# EasyEDA Pro project ProPrj_[LiThermal]热成像相机.epro, board V1.2_PCB
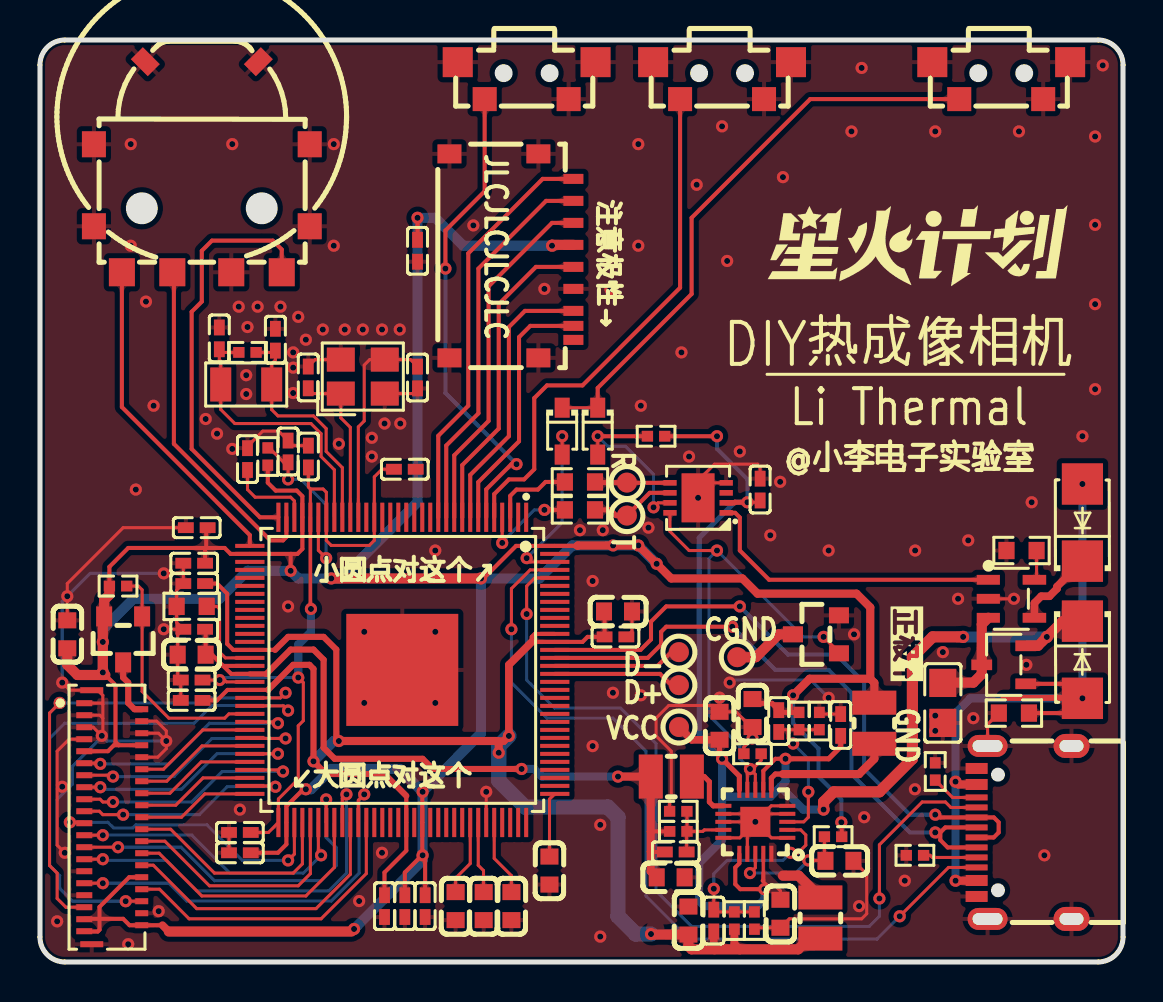
[diagram p6: board, top side]
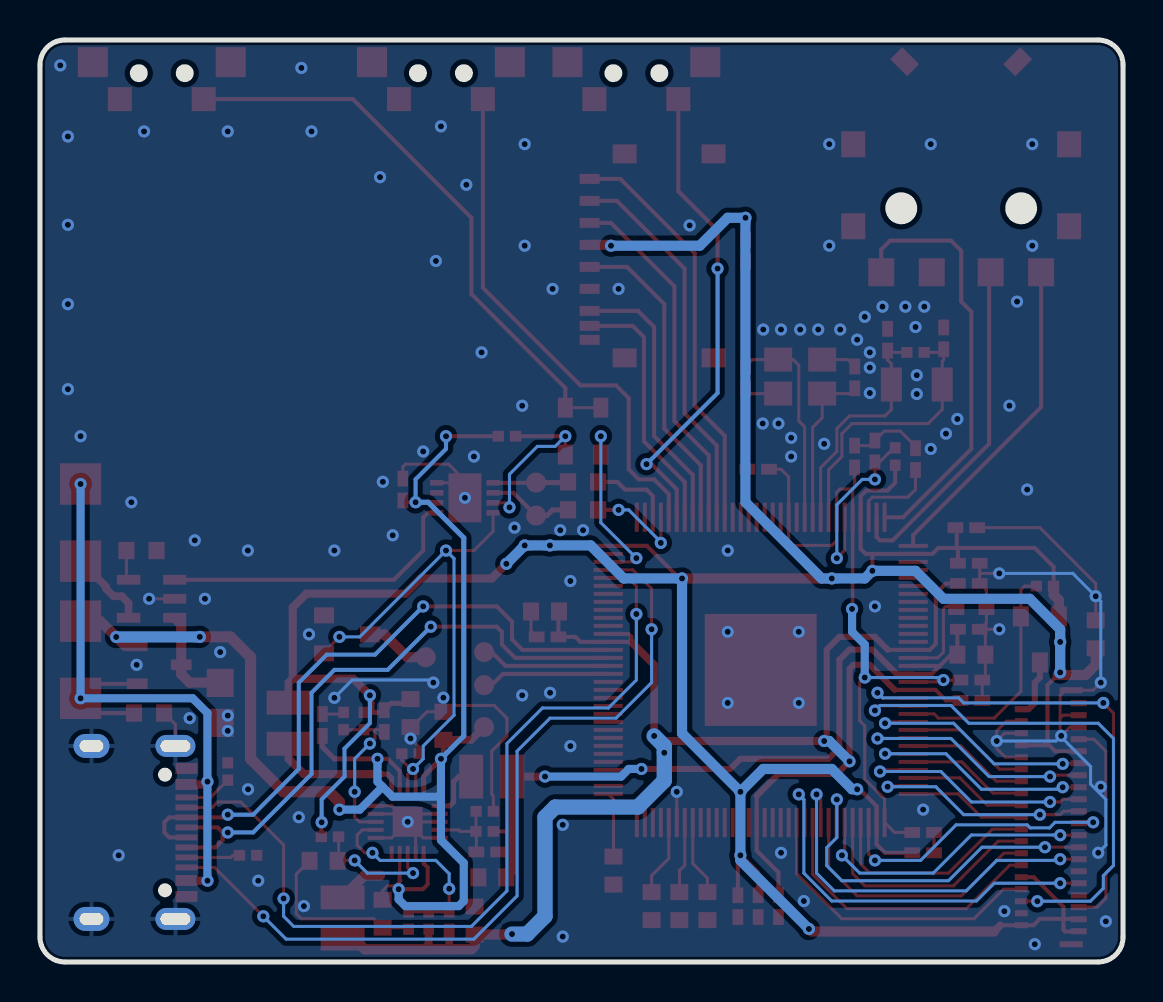
[diagram p7: board, bottom side, seen from below]

Outline 54.2 x 46.1 mm; copper layers: Top Layer, Bottom Layer. Coordinates in mm from the lower left corner of the outline.
Outline path: 0,44.85 arc(0.37,45.73) 1.25,46.1 52.95,46.1 arc(53.83,45.73) 54.2,44.85 54.2,1.25 arc(53.83,0.37) 52.95,0 1.25,0 arc(0.37,0.37) 0,1.25 0,44.85
Stack: Top Layer 0.035mm - / Dielectric1 1.11mm FR4 er 4.5 / Bottom Layer 0.035mm -

## Design rules (mm)
net USB0_DP: USB0_D
net USB0_DM: USB0_D
net USB1_DM: USB1_D
net USB1_DP: USB1_D
template: 自定义配置
spacing copperThickness1oz (default): track to track 0.102, other pairs 0.152 to 0.3
spacing copperThickness2oz: track to track 0.203, other pairs 0.152 to 0.3
track width copperThickness1oz (default): min 0.127, default 0.152, max 2.54
track width copperThickness2oz: min 0.203, default 0.254, max 2.54
track width trackWidth8: min 0.127, default 0.203, max 2.54
differential pair differentialPair (default): width min 0.127, default 0.178, max 2.54; gap min 0.152, default 0.152
via viaSize (default): diameter min 0.5, default 0.61, max 10; hole min 0.3, default 0.305, max 6.299
net 3V3 uses trackWidth8
net +5V uses trackWidth8
net 0V9 uses trackWidth8
net 1V5 uses trackWidth8

## Placement (name value [footprint] x y rotation side)
BAT1  NC  [C0805]  45.18 12.95 270 top
C1  12pF  [C0402]  13.43 29.23 90 top
C2  12pF  [C0402]  18.89 29.22 270 top
C3  10uF  [C0402]  12.42 25.53 270 top
C4  12pF  [C0402]  8.97 31.18 90 top
C5  12pF  [C0402]  11.78 31.12 90 top
C6  2.2uF  [C0603]  20.8 2.79 90 top
C7  10uF  [C0603]  23.59 2.79 90 top
C8  470nF  [C0603]  22.21 2.8 90 top
C9  10uF  [C0603]  25.5 4.57 90 top
C10  10uF  [C0603]  7.59 15.37 0 top
C11  100nF  [C0402]  7.72 16.64 0 top
C12  100nF  [C0402]  7.59 14.1 0 top
C15  100nF  [C0402]  10.38 25.15 270 top
C16  100nF  [C0402]  10 6.48 0 top
C17  100nF  [C0402]  10 5.46 0 top
C18  100nF  [C0402]  7.84 21.72 0 top
C19  100nF  [C0402]  7.72 19.94 0 top
C20  100nF  [C0402]  13.43 25.27 270 top
C21  100nF  [C0402]  18.26 24.64 180 top
C22  1uF  [C0402]  19.28 2.79 90 top
C23  100nF  [C0402]  18.26 2.79 90 top
C24  10uF  [C0603]  28.93 17.53 180 top
C25  100nF  [C0402]  28.8 16.26 180 top
C26  100nF  [C0402]  7.59 13.08 0 top
C27  100nF  [C0402]  7.72 18.92 0 top
C28  100nF  [C0402]  17.24 2.79 90 top
C29  10uF  [C0603]  34.01 11.81 270 top
C30  10uF  [C0603]  37.06 2.41 90 top
C31  1uF  [C0402]  40.07 11.85 270 top
C32  10uF  [C0603]  40.01 5.06 180 top
C33  10uF  [C0603]  31.56 4.23 180 top
C34  100nF  [C0402]  31.82 5.5 180 top
C35  10uF  [C0603]  35.66 12.45 90 top
C36  100nF  [C0402]  36.97 12.05 90 top
C37  10uF  [C0603]  32.45 2.07 270 top
C38  100nF  [C0402]  33.72 2.07 270 top
C39  10uF  [C0603]  1.37 16.38 270 top
C40  100nF  [C0402]  18.89 35.56 90 top
C43  100nF  [C0402]  36.04 23.62 270 top
CARD1  TF-018  [TF-SMD_TF-018]  23.59 35.31 90 top
D1  SS34-MS  [DO-214AC_L4.3-W2.7-LS5.0-RD]  52.17 15.11 270 top
D4  1N5819WS  [SOD-323_L1.8-W1.3-LS2.5-RD]  26.13 26.54 270 top
D5  1N5819WS  [SOD-323_L1.8-W1.3-LS2.5-RD]  27.91 26.54 270 top
D6  SS34-MS  [DO-214AC_L4.3-W2.7-LS5.0-RD]  52.17 21.97 90 top
FPC2  F0302-B-39-10G-R  [FFC-SMD_F0302-B-39-10G-R]  3.65 7.24 270 top
L1  2.2uH  [IND-SMD_L2.5-W2.0]  31.59 9.27 180 top
L2  2.2uH  [IND-SMD_L2.5-W2.0]  41.75 11.94 90 top
L3  2.2uH  [IND-SMD_L2.5-W2.0]  39.05 2.2 270 top
Q1  SI2301CDS-T1-GE3  [SOT-23-3_L3.0-W1.7-P0.95-LS2.9-BR]  48.23 14.86 0 top
Q2  AO3401A  [SOT-23_L2.9-W1.3-P1.90-LS2.4-BR]  4.16 16.13 90 top
Q3  AO3402  [SOT-23_L2.9-W1.3-P1.90-LS2.4-BR]  38.83 16.38 0 top
R1  10kΩ  [R0402]  11.4 25.27 270 top
R2  5.1MΩ  [R0402]  10.38 30.48 180 top
R3  240Ω  [R0603]  7.59 17.78 0 top
R4  100kΩ  [R0402]  39.69 6.26 0 top
R5  100kΩ  [R0402]  35.66 10.41 0 top
R6  100kΩ  [R0603]  48.74 12.45 180 top
R7  150kΩ  [R0402]  31.95 6.53 180 top
R8  68kΩ  [R0402]  37.99 12.05 90 top
R9  100kΩ  [R0402]  34.75 2.07 270 top
R10  100kΩ  [R0402]  31.94 7.53 0 top
R11  15kΩ  [R0402]  39 12.05 270 top
R12  200kΩ  [R0402]  35.75 2.07 90 top
R13  49.9kΩ  [R0402]  3.91 18.8 180 top
R20  5.1kΩ  [R0402]  44.8 9.53 90 top
R22  5.1kΩ  [R0402]  43.79 5.33 180 top
R28  0Ω  [R0603]  27.02 22.61 180 top
R29  0Ω  [R0603]  27.02 24 180 top
R30  2.2kΩ  [R0603]  49.12 20.57 0 top
R31  10kΩ  [R0402]  30.83 26.29 0 top
SW1  TS-1087B-B3D2  [KEY-SMD_4P-L7.8-W2.8-P4.20-EH]  48.1 44.07 0 top
SW2  TS-1087B-B3D2  [KEY-SMD_4P-L7.8-W2.8-P4.20-EH]  34.13 44.07 0 top
SW3  TS-1087B-B3D2  [KEY-SMD_4P-L7.8-W2.8-P4.20-EH]  24.35 44.07 0 top
TP1  网络  [TP-1.5MM]  29.37 22.32 90 top
TP2  网络  [TP-1.5MM]  29.37 23.97 90 top
TP3  网络  [TP-1.5MM]  31.98 11.75 270 top
TP4  网络  [TP-1.5MM]  31.97 15.49 270 top
TP5  网络  [TP-1.5MM]  31.97 13.84 270 top
TP6  网络  [TP-1.5MM]  34.9 15.24 180 top
U1  T113-S3  [LQFP-128_L14.0-W14.0-P0.40-LS16.0-BL-EP5.6]  18.13 14.61 180 top
U2  EA3036QDR  [QFN-20_L3.0-W3.0-P0.50-BL-EP1.7]  35.8 7.01 90 top
U5  STC8G1K08A-36I-DFN8  [DFN-8_L3.0-W3.0-P0.50-BL-EP]  32.93 23.21 90 top
U6  SIQ-02FVS3  [SW-SMD_SIQ-02FVS3_1]  8.1 39.75 0 top
U7  LTH7  [SOT-23-5_L3.0-W1.7-P0.95-LS2.8-BL]  48.61 18.16 270 top
USB1  TYPE-C 16PIN 2MD(073)  [USB-C-SMD_TYPE-C-6PIN-2MD-073]  49.25 6.48 90 top
X1  XL2EL89COI-111YLC-24M  [CRYSTAL-SMD_4P-L3.2-W2.5-BL]  16.16 29.27 0 top
X2  32.768kHz  [OSC-SMD_L3.2-W1.5]  10.32 28.88 180 top

## Footprints (pads in the part's own frame, mm; a bottom-side part is the same pattern mirrored in y, then rotated)
C0402
  rect 0.79x0.54 smd: 1(-0.545,0) 2(0.545,0)
C0603
  rect 0.8x0.9 smd: 1(-0.7,0) 2(0.7,0)
C0805
  rect 1.41x1.35 smd: 1(-1,0) 2(1,0)
CRYSTAL-SMD_4P-L3.2-W2.5-BL
  rect 1.4x1.2 smd: 1(-1.1,-0.85) 2(1.1,-0.85) 3(1.1,0.85) 4(-1.1,0.85)
DFN-8_L3.0-W3.0-P0.50-BL-EP
  rect 0.28x0.665 smd: 1(-0.75,-1.407) 2(-0.25,-1.407) 3(0.25,-1.407) 4(0.75,-1.407) 5(0.75,1.407) 6(0.25,1.407) 7(-0.25,1.407) 8(-0.75,1.407)
  rect 2.45x1.65 smd: 9(0,0)
DO-214AC_L4.3-W2.7-LS5.0-RD
  rect 2.07x2.06 smd: 1(-1.929,0) 2(1.929,0)
FFC-SMD_F0302-B-39-10G-R
  rect 0.3x0.8 smd: 1(-5.7,-1.438) 3(-5.1,-1.438) 5(-4.5,-1.438) 7(-3.9,-1.438) 9(-3.3,-1.438) 11(-2.7,-1.438) 13(-2.1,-1.438) 15(-1.5,-1.438) 17(-0.9,-1.438) 19(-0.3,-1.438) 21(0.3,-1.438) 23(0.9,-1.438) 25(1.5,-1.438) 27(2.1,-1.438) 29(2.7,-1.438) 31(3.3,-1.438) 33(3.9,-1.438) 35(4.5,-1.438) 37(5.1,-1.438) 39(5.7,-1.438)
  rect 0.3x0.65 smd: 2(-5.4,1.438) 4(-4.8,1.438) 6(-4.2,1.438) 8(-3.6,1.438) 10(-3,1.438) 12(-2.4,1.438) 14(-1.8,1.438) 16(-1.2,1.438) 18(-0.6,1.438) 20(0,1.438) 22(0.6,1.438) 24(1.2,1.438) 26(1.8,1.438) 28(2.4,1.438) 30(3,1.438) 32(3.6,1.438) 34(4.2,1.438) 36(4.8,1.438) 38(5.4,1.438)
  rect 0.3x1.15 smd: 40(6.35,-1.062) 41(-6.35,-1.062)
IND-SMD_L2.5-W2.0
  rect 1.2x2.2 smd: 1(1.028,0) 2(-1.028,0)
KEY-SMD_4P-L7.8-W2.8-P4.20-EH
  rect 1.2x1.2 smd: 1(-2.1,-0.924) 2(2.1,-0.924)
  rect 1.5x1.5 smd: 3(-3.45,0.924) 4(3.45,0.924)
LQFP-128_L14.0-W14.0-P0.40-LS16.0-BL-EP5.6
  rect 0.2x1.46 smd: 1(-6.2,-7.63) 2(-5.8,-7.63) 3(-5.4,-7.63) 4(-5,-7.63) 5(-4.6,-7.63) 6(-4.2,-7.63) 7(-3.8,-7.63) 8(-3.4,-7.63) 9(-3,-7.63) 10(-2.6,-7.63) 11(-2.2,-7.63) 12(-1.8,-7.63) 13(-1.4,-7.63) 14(-1,-7.63) 15(-0.6,-7.63) 16(-0.2,-7.63) 17(0.2,-7.63) 18(0.6,-7.63) 19(1,-7.63) 20(1.4,-7.63) 21(1.8,-7.63) 22(2.2,-7.63) 23(2.6,-7.63) 24(3,-7.63) 25(3.4,-7.63) 26(3.8,-7.63) 27(4.2,-7.63) 28(4.6,-7.63) 29(5,-7.63) 30(5.4,-7.63) 31(5.8,-7.63) 32(6.2,-7.63) 65(6.2,7.63) 66(5.8,7.63) 67(5.4,7.63) 68(5,7.63) 69(4.6,7.63) 70(4.2,7.63) 71(3.8,7.63) 72(3.4,7.63) 73(3,7.63) 74(2.6,7.63) 75(2.2,7.63) 76(1.8,7.63) 77(1.4,7.63) 78(1,7.63) 79(0.6,7.63) 80(0.2,7.63) 81(-0.2,7.63) 82(-0.6,7.63) 83(-1,7.63) 84(-1.4,7.63) 85(-1.8,7.63) 86(-2.2,7.63) 87(-2.6,7.63) 88(-3,7.63) 89(-3.4,7.63) 90(-3.8,7.63) 91(-4.2,7.63) 92(-4.6,7.63) 93(-5,7.63) 94(-5.4,7.63) 95(-5.8,7.63) 96(-6.2,7.63)
  rect 1.46x0.2 smd: 33(7.63,-6.2) 34(7.63,-5.8) 35(7.63,-5.4) 36(7.63,-5) 37(7.63,-4.6) 38(7.63,-4.2) 39(7.63,-3.8) 40(7.63,-3.4) 41(7.63,-3) 42(7.63,-2.6) 43(7.63,-2.2) 44(7.63,-1.8) 45(7.63,-1.4) 46(7.63,-1) 47(7.63,-0.6) 48(7.63,-0.2) 49(7.63,0.2) 50(7.63,0.6) 51(7.63,1) 52(7.63,1.4) 53(7.63,1.8) 54(7.63,2.2) 55(7.63,2.6) 56(7.63,3) 57(7.63,3.4) 58(7.63,3.8) 59(7.63,4.2) 60(7.63,4.6) 61(7.63,5) 62(7.63,5.4) 63(7.63,5.8) 64(7.63,6.2) 97(-7.63,6.2) 98(-7.63,5.8) 99(-7.63,5.4) 100(-7.63,5) 101(-7.63,4.6) 102(-7.63,4.2) 103(-7.63,3.8) 104(-7.63,3.4) 105(-7.63,3) 106(-7.63,2.6) 107(-7.63,2.2) 108(-7.63,1.8) 109(-7.63,1.4) 110(-7.63,1) 111(-7.63,0.6) 112(-7.63,0.2) 113(-7.63,-0.2) 114(-7.63,-0.6) 115(-7.63,-1) 116(-7.63,-1.4) 117(-7.63,-1.8) 118(-7.63,-2.2) 119(-7.63,-2.6) 120(-7.63,-3) 121(-7.63,-3.4) 122(-7.63,-3.8) 123(-7.63,-4.2) 124(-7.63,-4.6) 125(-7.63,-5) 126(-7.63,-5.4) 127(-7.63,-5.8) 128(-7.63,-6.2)
  rect 5.6x5.6 smd: 129(0,0)
OSC-SMD_L3.2-W1.5
  rect 1.05x1.7 smd: 1(-1.275,0) 2(1.275,0)
QFN-20_L3.0-W3.0-P0.50-BL-EP1.7
  rect 0.2x0.8 smd: 1(-0.8,-1.6) 2(-0.4,-1.6) 3(0,-1.6) 4(0.4,-1.6) 5(0.8,-1.6) 11(0.8,1.6) 12(0.4,1.6) 13(0,1.6) 14(-0.4,1.6) 15(-0.8,1.6)
  rect 0.8x0.2 smd: 6(1.6,-0.8) 7(1.6,-0.4) 8(1.6,0) 9(1.6,0.4) 10(1.6,0.8) 16(-1.6,0.799) 17(-1.6,0.4) 18(-1.6,0) 19(-1.6,-0.4) 20(-1.598,-0.802)
  rect 1.5x1.5 smd: 21(0,0)
R0402
  rect 0.566x0.54 smd: 1(-0.433,0) 2(0.433,0)
R0603
  rect 0.806x0.864 smd: 1(-0.753,0) 2(0.753,0)
SOD-323_L1.8-W1.3-LS2.5-RD
  rect 1x0.75 smd: 1(-1.173,0) 2(1.173,0)
SOT-23-3_L3.0-W1.7-P0.95-LS2.9-BR
  rect 1.038x0.532 smd: 1(1.101,-0.95) 2(1.101,0.95) 3(-1.101,0)
SOT-23-5_L3.0-W1.7-P0.95-LS2.8-BL
  rect 0.49x1.157 smd: 1(-0.95,-1.153) 2(0,-1.153) 3(0.95,-1.153)
  rect 0.49x1.175 smd: 4(0.95,1.153) 5(-0.95,1.153)
SOT-23_L2.9-W1.3-P1.90-LS2.4-BR
  rect 1x0.8 smd: 1(1.15,-0.95) 2(1.15,0.95) 3(-1.15,0)
SW-SMD_SIQ-02FVS3_1
  rect 1.2x1.3 smd: 1(5.4,-2.964) 2(5.4,1.136) 5(-5.4,1.136) 6(-5.4,-2.964)
  rect 0.85x1.2 smd rot 135: 3(2.829,5.264)
  rect 0.85x1.2 smd rot 45: 4(-2.829,5.264)
  rect 1.3x1.4 smd: A(-4,-5.264) B(4,-5.264) C(1.475,-5.264) S(-1.475,-5.264)
TF-SMD_TF-018
  rect 0.5x1 smd: 1(3.85,-3.1) 2(2.75,-3.1) 3(1.65,-3.1) 4(0.55,-3.1) 5(-0.55,-3.1) 6(-1.65,-3.1) 7(-2.75,-3.1) 8(-3.5,-3.1) 9(-4.2,-3.1)
  rect 0.95x1.2 smd: 10(-5.1,3.1) 10(-5.1,-1.35) 10(5.1,3.1) 10(5.1,-1.35)
TP-1.5MM
  round 1 smd: 1(0,0)
USB-C-SMD_TYPE-C-6PIN-2MD-073
  rect 0.55x1.1 smd: 1(-3.2,2.375) 2(-2.4,2.375) 11(2.4,2.375) 12(3.2,2.375)
  rect 0.3x1.1 smd: 3(-1.75,2.375) 4(-1.25,2.375) 5(-0.75,2.375) 6(-0.25,2.375) 7(0.25,2.375) 8(0.75,2.375) 9(1.25,2.375) 10(1.75,2.375)
  oval 1.1x2 hole 0.6x1.5: 13(-4.325,1.825) 14(4.325,1.825)
  oval 1.2x1.8 hole 0.6x1.2: 13(-4.325,-2.375) 14(4.325,-2.375)

## Nets
As in the schematic.

Pads without a net: CARD1 9; U1 21 77 78 93 94 95 96 102 103 104 105 106 107 108 109 110 111; U5 3

## Via types
v1: diameter 0.61, hole 0.305, Top Layer to Bottom Layer, 199 vias

## Routing (per net, layer and track width the routed paths; a pad name or vN(x,y) marks a point on that pad's centre or on a via; arc(x,y) is an arc through that point)
0V9: length 86.7
  Top Layer w0.203: C24.2 28.25,17.5 C25.2 27.4,16.26 27.15,16.01 U1.116 24.61,16.01 24.61,16.26 24.76,16.41 U1.117 ; 13.88,10.1 13.75,10.1 v1(13.69,10.03) ; C28.2 17.24,4.48 18.33,5.57 U1.81 18.33,8.31 ; 11.42,13.61 U1.51 9.38,13.61 8.86,13.08 C26.2 ; C27.2 8.86,18.92 9.37,18.42 9.37,15.91 9.67,15.61 U1.46 11.77,15.61
  Top Layer w0.305: v1(14.96,11.05) 14.83,11.18 14.83,15.62 14.19,16.26 12.42,16.26 11.77,15.61 ; 11.42,13.61 12.67,14.86 13.48,14.86 13.69,14.66 v1(13.69,10.03) 14.32,9.4 17.24,9.4 18.33,8.31
  Top Layer w0.381: 24.61,16.01 23.47,14.86 v1(23.47,11.3) 23.21,11.05 22.87,11.05 ; 35.02,0.64 34.75,0.91 R9.2 ; C38.2 33.72,0.67 33.75,0.64
  Top Layer w0.406: v1(14.96,11.05) 22.87,11.05 22.96,10.96 v1(22.96,10.46)
  Top Layer w0.508: v1(30.58,1.4) 30.6,1.37 C37.2 32.45,0.79 32.61,0.64 37.94,0.64 38.48,1.17 L3.1
  Bottom Layer w0.508: v1(13.69,10.03) 14.7,11.05 v1(14.96,11.05)
  Bottom Layer w0.762: v1(30.58,1.4) 29.82,1.4 28.93,2.29 28.93,7.24 28.42,7.75 24.28,7.75 22.96,9.07 v1(22.96,10.46) 22.96,10.8 v1(23.47,11.3)
1V5: length 37.8
  Top Layer w0.203: 9.18,14.79 9.19,14.81 U1.48 ; 9.18,14.79 9.57,14.41 U1.49 ; 9.18,14.79 8.61,15.37 C10.2 8.29,16.61 C11.2 ; C34.2 30.58,5.5 30.57,5.52 ; 30.57,6.52 30.58,6.53 R7.2
  Top Layer w0.254: U1.49 11.33,14.41
  Top Layer w0.305: 11.33,14.41 12.54,15.62 13.69,15.62 14.19,15.11 14.19,10.71 14.75,10.16 19.15,10.16 19.66,9.65 v1(24.1,9.65)
  Top Layer w0.406: v1(28.93,9.27) L1.1 30.57,4.53 C33.2
  Bottom Layer w0.406: v1(28.93,9.27) 25.12,9.27 24.74,9.65 v1(24.1,9.65)
3V3: length 196
  Top Layer w0.203: 37.59,12.48 37.56,12.51 37.56,12.95 37.69,13.08 v1(37.69,13.34) ; FPC2.37 2.24,2.16 2.98,2.16 ; 3.94,10.84 3.78,11 3.78,13.84 v1(3.15,14.48) ; 3.94,10.84 3.7,10.84 3.4,10.54 FPC2.9 ; 3.94,10.84 FPC2.8 ; v1(40.1,6.98) 40.12,6.97 R4.2 ; 2.98,2.16 2.98,1.61 2.89,1.52 2.23,1.52 FPC2.39 ; 2.98,2.16 4.16,2.16 4.48,1.84 FPC2.38 6.13,1.84 ; 2.98,2.16 2.98,2.76 4.46,4.24 FPC2.30 ; C22.2 19.28,5.21 v1(19.15,5.33) 19.13,5.35 ; v1(22.07,19.18) 22.2,19.18 23.82,20.81 U1.128 26.9,20.81 ; 8.32,20.7 4.42,20.7 3.47,19.76 R13.2 ; 8.32,20.7 8.26,20.65 C19.2 ; 8.32,20.7 9.24,20.7 9.54,20.41 U1.34 12.56,20.41 ; 8.32,20.7 8.32,21.65 C18.2 ; 10.55,5.59 C17.2 11.91,5.46 12.33,5.88 U1.66 12.33,7.79 13.18,8.64 v1(13.31,8.64) ; v1(12.54,19.56) 12.54,20.39 12.56,20.41 ; C23.2 18.26,4.48 19.13,5.35 ; 12.56,20.41 12.88,20.41 13.13,20.65 U1.29 13.13,23.29 12.85,23.57 11.8,23.57 11.4,23.97 R1.2 ; 15.59,1.52 v1(15.72,1.65) ; v1(18.89,37.21) C40.2 ; v1(19.15,8.51) 19.13,8.49 U1.83 19.13,5.35
  Top Layer w0.254: 35.75,12.93 36.63,12.93 C36.2 37.08,12.48 R8.2
  Top Layer w0.381: 6.13,1.84 6.45,1.52
  Top Layer w0.406: 41.55,14.16 38.52,14.16 v1(37.69,13.34) ; 41.55,14.16 41.55,17.73 40.87,18.42 35.91,18.42 35.15,19.18 31.59,19.18 v1(30.86,19.91) v1(29.94,20.83) v1(28.68,20.83) 26.92,20.83 26.9,20.81 ; 41.55,14.16 41.75,13.96 L2.1
  Top Layer w0.508: v1(3.15,14.48) v1(3.15,16) 3.15,17.21 Q2.2 3.21,18.1 3.47,18.36 R13.2 ; 6.45,1.52 15.59,1.52 ; v1(25.62,35.81) 25.62,35.86 CARD1.4 ; C39.2 1.37,14.86 1.88,14.35 3.27,14.35 ; v1(14.58,19.18) v1(22.07,19.18)
  Bottom Layer w0.203: v1(40.1,6.98) 40.1,8.13 38.96,9.27 38.96,10.67 37.69,11.94 v1(37.69,13.34)
  Bottom Layer w0.508: v1(19.15,8.51) 18,9.65 14.58,9.65 13.56,8.64 v1(13.31,8.64) ; v1(19.15,8.51) v1(19.15,5.33) 19.15,5.08 v1(15.72,1.65) ; v1(19.15,8.51) 22.07,11.43 v1(22.07,19.18) 24.99,19.18 26.64,20.83 v1(28.68,20.83) v1(29.94,20.83) v1(30.86,19.91) ; v1(3.15,14.48) v1(3.15,16) 3.15,16.64 4.67,18.16 8.99,18.16 10.38,19.56 v1(12.54,19.56) 12.93,19.18 v1(14.58,19.18) 15.08,19.18 18.89,22.99 v1(18.89,37.21) 19.78,37.21 21.18,35.81 v1(25.62,35.81)
+5V: length 38
  Top Layer w0.203: R6.1 51.43,12.45 v1(52.17,13.18) ; 52.14,13.21 51.44,13.91 Q1.1
  Top Layer w0.305: 48.23,13.21 52.14,13.21 v1(52.17,13.18)
  Top Layer w0.406: USB1.11 45.96,8.88 v1(45.82,9.02) ; v1(45.82,4.06) 46.86,4.06 USB1.2
  Bottom Layer w0.406: v1(45.82,4.06) v1(45.82,9.02) 45.82,12.45 46.56,13.18 v1(52.17,13.18) v1(52.17,23.9)
AVCC: length 3.8
  Top Layer w0.152: U1.89 21.53,4.92 20.8,4.19 C6.2
GND: length 115.8
  Top Layer w0.152: C20.1 12.67,25.82 C3.1 11.95,26.54 11.15,26.54 10.38,25.78 C15.1 ; FPC2.1 3.09,12.94 3.15,12.88 ; C2.2 18.64,28.42 X1.2 ; v1(6.19,19.43) 7.12,19.43 7.17,19.48 ; FPC2.3 3,12.34 3.15,12.19 ; C32.1 41.37,4.39 41.37,2.41 41.12,2.16 37.5,2.16 C30.1 35.83,1.71 R12.1 ; C19.1 7.17,19.48 ; 7.17,19.48 C27.1 6.84,18.59 R3.1 6.84,16.97 C11.1 ; U2.17 35.4,6.58 ; 35.4,6.58 35.4,6.61 ; 35.4,6.58 35.02,6.21 U2.15 ; U1.91 v1(22.33,8.51) ; C11.1 6.89,16.36 C10.1 6.89,14.25 7.05,14.1 7.05,13.08 ; C11.1 v1(6.19,16.64) ; R5.1 35.22,10.74 v1(35.66,11.18) 35.66,11.68 34.83,12.51 C29.1 33.69,12.83 31.47,12.83 30.83,12.19 30.83,11.3 31.59,10.54 31.59,8.38 31.51,8.3 R10.1 ; 3.15,12.88 3.15,12.19 ; 3.15,12.88 3.15,13.34 2.89,13.59 FPC2.41 1.5,13.59 v1(1.11,13.97) ; 3.15,12.19 3.15,11.36 v1(3.1,11.31) 2.66,11.74 FPC2.5 ; USB1.14 47.42,11.88 R6.2 ; C17.1 C16.1 ; U2.5 36.6,7.81 36.2,7.41 U2.4 ; C43.1 36.04,24.77 35.91,24.89 33.75,24.89 32.93,24.07 v1(32.93,23.21) 33.68,23.96 U5.4 ; FPC2.7 1.46,11.14 0.86,10.54 0.86,5.84 v1(1.24,5.46) ; C24.1 29.63,16.54 C25.1 ; C31.1 39.09,12.4 R11.1 ; v1(48.74,18.16) U7.2 ; v1(6.32,11.05) 5.93,11.44 FPC2.6 ; v1(6.32,11.05) 6.32,10.67 5.89,10.24 FPC2.10 ; v1(6.32,11.05) 6.32,11.56 5.84,12.04 FPC2.4 ; U2.12 35.4,7.41 ; X1.4 13.77,30.12 C1.2 ; C18.1 4.16,21.72 1.37,18.92 v1(1.37,18.29) C39.1 ; U2.13 v1(35.8,7.01) 36.6,6.21 U2.1
  Bottom Layer w0.152: v1(6.32,11.05) 3.35,11.05 v1(3.1,11.31) 3.1,11.25 1.62,9.78 1.62,8.89 0.86,8.13 0.86,5.84 v1(1.24,5.46) ; v1(34.51,13.97) 34.64,14.1 38.58,14.1 v1(39.47,13.21) ; v1(1.11,13.97) 1.11,18.03 v1(1.37,18.29) 2.51,19.43 v1(6.19,19.43)
  vias: v1(0.86,2.03) v1(1.11,8.76) v1(4.42,0.89) v1(4.54,40.89) v1(4.54,35.81) v1(4.8,23.62) v1(5.31,33.02) v1(5.69,27.81) v1(5.94,2.54) v1(8.29,27.15) v1(8.86,26.42) v1(9.62,40.89) v1(9.62,25.65) v1(9.95,32.77) v1(10,7.62) v1(10.32,29.34) v1(10.32,28.4) v1(10.38,31.75) v1(10.89,32.77) v1(12.04,32.77) v1(12.42,17.78) v1(12.67,30.48) v1(12.67,29.72) v1(12.67,28.45) v1(12.93,32.26) v1(13.31,31.12) v1(14.15,31.62) v1(14.7,40.89) v1(14.7,35.81) v1(14.96,25.91) v1(15.25,31.62) v1(15.97,3.05) v1(16.16,31.62) v1(16.23,16.51) v1(16.23,12.95) v1(16.61,26.21) v1(16.61,25.27) v1(17.12,31.62) v1(17.12,5.46) v1(17.24,26.92) v1(18,31.62) v1(18.03,26.92) v1(19.78,20.57) v1(19.78,16.51) v1(19.78,12.95) v1(21.69,36.83) v1(25.24,33.66) v1(27.02,21.59) v1(27.66,19.05) v1(27.66,10.8) v1(28.04,6.86) v1(28.04,1.27) v1(28.16,21.59) v1(28.55,33.66) v1(28.67,13.46) v1(29.94,40.89) v1(29.94,35.81) v1(30.07,27.81) v1(30.07,13.34) v1(30.45,21.72) v1(32.1,30.48) v1(32.48,25.27) v1(32.86,38.86) v1(34.01,13.22) v1(34.13,41.78) v1(34.39,35.05) v1(35.02,25.53) v1(36.55,21.34) v1(37.04,24.01) v1(37.18,39.24) v1(39.47,20.57) v1(40.61,41.53) v1(40.74,16.38) v1(40.99,2.79) v1(41.12,44.7) v1(41.25,7.24) v1(43.28,4.06) v1(43.8,20.57) v1(43.79,8.64) v1(44.8,41.53) v1(44.8,12.32) v1(44.8,11.56) v1(45.18,15.49) v1(45.94,18.16) v1(46.45,21.08) v1(46.71,12.19) v1(48.99,41.53) v1(49.36,14.86) v1(49.63,22.99) v1(50.26,5.33) v1(52.17,26.29) v1(52.8,41.28) v1(52.8,36.86) v1(52.8,32.89) v1(52.8,28.64) v1(53.18,44.83)
VBAT: length 5.1
  Top Layer w0.508: U7.3 47.13,16.88 Q1.3 47.13,14.39 46.71,13.97 45.2,13.97 BAT1.1
VCC_PMU: length 80.5
  Top Layer w0.152: C30.2 37.06,3.56 36.8,3.81 36.42,3.81 36.2,4.03 36.2,4.1 ; v1(35.4,22.99) 35.95,22.99 C43.2 ; 36.2,4.46 U2.19
  Top Layer w0.203: v1(37.31,10.16) 36.8,10.16 36.2,9.56 U2.7 ; v1(33.88,26.29) R31.2 ; 36.2,4.46 36.2,4.1 36.17,4.06 ; 36.42,3.81 v1(36.25,3.64) 35.05,3.64 34.8,3.89 34.8,4.73 35,4.93 U2.16
  Top Layer w0.254: v1(35.4,22.99) 34.78,22.99 34.75,22.96 U5.2 ; C31.2 40.07,10.76 39.47,10.16 v1(37.31,10.16) ; U2.10 35,9.29 34.01,10.29 C29.2
  Top Layer w0.381: TP3.1 32.62,11.11 C29.2
  Top Layer w0.508: Q1.2 49.94,15.81 v1(50.39,16.25) 51.18,17.04 D1.1
  Top Layer w0.559: v1(39.21,7.62) 39.21,8 39.72,8.51 42.01,8.51 43.66,10.16 43.66,15.24 44.68,16.26 v1(46.2,16.26)
  Bottom Layer w0.203: v1(33.88,26.29) 33.88,25.65 35.4,24.13 v1(35.4,22.99)
  Bottom Layer w0.254: v1(35.4,22.99) 34.77,22.99 32.99,21.21 32.99,11.3 v1(34.13,10.16)
  Bottom Layer w0.406: v1(36.25,3.64) 36.25,3.13 35.91,2.79 33.25,2.79 32.99,3.05 32.99,4.95 34.13,6.1 34.13,8.27 ; v1(39.21,7.62) 38.2,7.62 37.06,8.76 ; v1(34.13,10.16) 34.13,8.27 ; 34.13,8.27 36.56,8.27 37.06,8.76 ; 37.06,8.76 37.31,9.02 v1(37.31,10.16)
  Bottom Layer w0.559: v1(46.2,16.26) 46.2,16.25 v1(50.39,16.25)
BATT_CHRG_MCU: length 15.5
  Top Layer w0.203: U5.1 34.79,22.46 35.02,22.23 35.02,20.57 36.49,19.11 U7.1
CAM_GND: length 3
  Top Layer w0.508: Q3.3 36.96,16.38 35.82,15.24 35.15,15.24
DXIN: length 8.1
  Top Layer w0.152: C1.1 13.69,28.42 X1.1 15.06,27.21 15.53,26.73 U1.23
DXOUT: length 10.7
  Top Layer w0.152: C2.1 18.54,30.12 X1.3 16.5,30.12 16.23,29.84 16.23,27.05 15.93,26.76 15.93,22.23
DZQ: length 4.5
  Top Layer w0.152: R3.2 8.86,17.78 8.99,17.65 8.99,15.49 9.28,15.2 U1.47
EN1: length 27.2
  Top Layer w0.152: U5.8 31.53,21.53 32.48,20.57 v1(33.88,20.57) ; U2.8 35.8,9.38 35.66,9.53 35.53,9.53 ; Q3.1 39.98,15.49 v1(39.21,16.26) ; R5.2 36.09,10.09 35.66,9.65 v1(35.53,9.65) 35.53,9.53 ; 35.53,9.53 35.4,9.39 U2.9
  Bottom Layer w0.152: v1(35.53,9.65) 35.02,10.16 35.02,10.8 33.48,12.34 33.48,20.17 v1(33.88,20.57) 38.2,16.26 v1(39.21,16.26)
EN3: length 6.3
  Top Layer w0.152: 39.29,5.08 C32.2 ; 39.29,5.08 v1(38.45,5.08) ; 39.29,5.08 39.26,5.11 R4.1 ; U2.18 35.8,4.71 v1(35.53,4.45)
  Bottom Layer w0.152: v1(38.45,5.08) 37.82,4.45 v1(35.53,4.45)
FB1: length 3.9
  Top Layer w0.152: C34.1 32.36,6.51 R7.1 ; R7.1 32.38,7.53 R10.2 ; R7.1 33.17,6.53 33.25,6.6 34.2,6.6 U2.14
FB2: length 8
  Top Layer w0.152: 36.97,11.5 37.08,11.61 37.48,11.61 ; v1(38.45,8.51) 38.45,7.24 38.22,7.01 U2.3 ; v1(37.69,10.92) 37.44,11.18 37.44,11.57 37.48,11.61 ; 39,11.61 37.48,11.61
  Bottom Layer w0.152: v1(37.69,10.92) 38.45,10.16 v1(38.45,8.51)
FB3: length 10.6
  Top Layer w0.152: v1(37.56,5.46) 37.94,5.46 38.32,5.84 38.32,6.35 38.07,6.61 U2.2 ; R12.2 33.83,2.51 C38.1 v1(33.72,3.66)
  Bottom Layer w0.152: v1(37.56,5.46) 37.18,5.08 34.39,5.08 33.72,4.41 v1(33.72,3.66)
HPVCC: length 3.2
  Top Layer w0.152: U1.97 25.5,8.14 C9.2
KEY_MCU: length 9.6
  Top Layer w0.152: U5.7 30.93,22.96 v1(30.71,22.73) ; D5.2 v1(27.91,26.29)
  Top Layer w0.203: R31.1 v1(27.91,26.29)
  Bottom Layer w0.152: v1(30.71,22.73) 30.71,24.38 29.31,25.78 28.42,25.78 v1(27.91,26.29)
KEY_SOC: length 9.2
  Top Layer w0.152: D4.2 v1(26.13,26.29) ; v1(24.35,20.19) 24.54,20.01 U1.126
  Bottom Layer w0.152: v1(26.13,26.29) 26.13,21.97 v1(24.35,20.19)
KEY_SW: length 29.1
  Top Layer w0.152: D4.1 D5.1
  Top Layer w0.203: D5.1 27.91,28.7 32.61,33.4 32.61,37.21 38.54,43.15 SW1.1
LCD_BL: length 2.8
  Top Layer w0.305: FPC2.2 4.73,12.64 4.42,12.95 4.42,13.97 4.16,14.22 4.16,14.85
LCD_DB0: length 12
  Top Layer w0.152: v1(11.91,11.94) 11.84,12.01 U1.55 ; FPC2.11 2.73,9.94 2.77,9.91 v1(3.02,9.91)
  Bottom Layer w0.152: v1(11.91,11.94) 8.48,11.94 6.45,9.91 v1(3.02,9.91)
LCD_DB1: length 6.2
  Top Layer w0.152: U1.56 8.15,11.61 6.18,9.64 FPC2.12
LCD_DB2: length 12.7
  Top Layer w0.152: U1.57 10.53,11.18 v1(12.29,11.18) ; FPC2.13 3.59,9.34 v1(3.65,9.27)
  Bottom Layer w0.152: v1(12.29,11.18) 8.61,11.18 6.7,9.27 v1(3.65,9.27)
LCD_DB3: length 6.1
  Top Layer w0.152: U1.58 8.11,10.81 6.34,9.04 FPC2.14
LCD_DB4: length 11.9
  Top Layer w0.152: U1.59 10.51,10.41 v1(11.91,10.41) ; FPC2.15 v1(3.02,8.74)
  Bottom Layer w0.152: v1(3.02,8.74) 3.12,8.64 7.08,8.64 8.86,10.41 v1(11.91,10.41)
LCD_DB5: length 6.1
  Top Layer w0.152: FPC2.16 6.5,8.44 8.07,10.01 U1.60
LCD_DB6: length 12.3
  Top Layer w0.152: FPC2.17 3.01,8.14 3.15,8 v1(3.65,8) ; v1(12.16,9.53) 12.08,9.61 U1.61
  Bottom Layer w0.152: v1(12.16,9.53) 9.12,9.53 7.59,8 v1(3.65,8)
LCD_DB7: length 6
  Top Layer w0.152: FPC2.18 6.79,7.84 8.16,9.2 U1.62
LCD_DB8: length 11.5
  Top Layer w0.152: U1.63 11.49,8.81 11.53,8.76 v1(11.78,8.76) ; FPC2.19 2.97,7.54 3.15,7.37 v1(4.16,7.37)
  Bottom Layer w0.152: v1(4.16,7.37) 7.97,7.37 9.37,8.76 v1(11.78,8.76)
LCD_DB9: length 5.9
  Top Layer w0.152: U1.64 8.25,8.41 7.08,7.24 FPC2.20
LCD_DB10: length 14.6
  Top Layer w0.152: v1(1.5,6.98) 2.17,6.98 FPC2.21 ; v1(12.42,5.08) 12.73,5.4 U1.67
  Bottom Layer w0.152: v1(1.5,6.98) 3.4,6.98 3.68,6.71 4.64,6.71 4.8,6.86 8.35,6.86 10.13,5.08 v1(12.42,5.08)
LCD_DB11: length 11.2
  Top Layer w0.152: U1.68 13.13,4.91 12.67,4.45 8.73,4.45 6.54,6.64 FPC2.22
LCD_DB12: length 14.7
  Top Layer w0.152: FPC2.23 v1(3.15,6.34) ; 13.93,6.98 13.93,5.47 v1(14.07,5.33)
  Bottom Layer w0.152: v1(14.07,5.33) 13.18,4.45 9.5,4.45 7.59,6.35 3.15,6.35 v1(3.15,6.34)
LCD_DB13: length 12.2
  Top Layer w0.152: FPC2.24 6.25,6.04 8.48,3.81 12.93,3.81 13.53,4.42 U1.69
LCD_DB14: length 18.3
  Top Layer w0.152: FPC2.25 v1(3.91,5.74) ; v1(14.32,8.13) 14.32,6.98 U1.71
  Bottom Layer w0.152: v1(3.91,5.74) 7.06,5.74 8.73,4.06 14.07,4.06 14.83,4.83 14.83,5.72 14.32,6.22 v1(14.32,8.13)
LCD_DB15: length 13.4
  Top Layer w0.152: U1.72 14.73,4.73 13.31,3.3 8.1,3.3 5.96,5.44 FPC2.26
LCD_DB16: length 19.6
  Top Layer w0.152: FPC2.27 v1(3.15,5.14) ; v1(15.34,8.38) 15.13,8.18 U1.73
  Bottom Layer w0.152: v1(3.15,5.14) 3.15,5.08 6.32,5.08 7.84,3.56 14.45,3.56 15.34,4.45 v1(15.34,8.38)
LCD_DB17: length 14.6
  Top Layer w0.152: U1.74 15.53,4.39 13.81,2.67 7.84,2.67 5.67,4.84 FPC2.28
LCD_RESET: length 25.1
  Top Layer w0.152: v1(12.29,13.46) 12.03,13.2 U1.52 ; v1(0.99,12.95) 0.48,12.45 0.48,4.83 0.86,4.45 0.86,3.17 1.3,2.74 FPC2.35
  Bottom Layer w0.152: v1(12.29,13.46) 12.04,13.21 8.23,13.21 7.97,12.95 v1(0.99,12.95)
LCD_RS: length 15.3
  Top Layer w0.152: FPC2.32 5.98,3.64 7.46,2.16 14.07,2.16 16.33,4.42 U1.76
LCD_TE: length 26.8
  Top Layer w0.152: FPC2.34 v1(4.29,3.04) ; v1(12.42,12.57) 12.19,12.81 U1.53
  Bottom Layer w0.152: v1(12.42,12.57) 12.16,12.83 8.61,12.83 7.72,11.94 1.24,11.94 0.48,11.18 0.48,4.83 0.99,4.32 0.99,3.68 1.63,3.04 v1(4.29,3.04)
LCD_WR: length 20.3
  Top Layer w0.152: FPC2.31 v1(3.15,3.94) ; 15.93,6.98 15.93,8.09 v1(16.23,8.38)
  Bottom Layer w0.152: v1(3.15,3.94) 6.45,3.94 7.34,3.05 14.58,3.05 15.97,4.45 15.97,8.13 v1(16.23,8.38)
LDOA_OUT: length 36.9
  Top Layer w0.152: v1(12.93,14.22) 13.18,13.97 13.18,12.06 12.93,11.81 12.93,9.14 11.93,8.15 11.93,6.98 11.43,6.48 C16.2 ; 13.53,23.65 13.43,23.75 C20.2 ; 13.53,23.65 14.17,23.65 14.33,23.48 U1.26 14.33,21.07 14.58,20.83 16.48,20.83 16.73,21.08 U1.20 16.73,24.25 17.12,24.64 C21.2 ; 13.53,23.65 U1.28 ; U1.50 9.33,14.01 9.24,14.1 v1(8.99,14.1) C12.2
  Top Layer w0.178: U1.28 13.53,17.68 v1(13.56,17.65)
  Bottom Layer w0.152: v1(12.93,14.22) 9.12,14.22 v1(8.99,14.1)
  Bottom Layer w0.406: v1(12.93,14.22) 12.93,15.88 13.56,16.51 v1(13.56,17.65)
LDOB_OUT: length 4.4
  Top Layer w0.152: U1.30 12.73,23.05 12.54,23.24 10.77,23.24 10.38,23.62 C15.2
LX1: length 2.8
  Top Layer w0.254: L1.2 33.25,9.27 33.5,9.02 33.5,8 33.69,7.81 U2.11
LX2: length 6.9
  Top Layer w0.254: 37.18,9.4 36.8,9.4 36.6,9.2 U2.6
  Top Layer w0.406: L2.2 41.75,10.16 40.99,9.4 37.18,9.4
LX3: length 2.3
  Top Layer w0.508: L3.2 37.96,4.32 37.18,4.32
MCU_RX: length 3.8
  Top Layer w0.152: 29.38,23.96 TP2.1
  Top Layer w0.203: U5.5 29.38,23.96
  Top Layer w0.254: R29.1 27.81,23.97 TP2.1
MCU_TX: length 4.3
  Top Layer w0.203: TP1.1 30.51,23.46 U5.6
  Top Layer w0.254: R28.1 28.55,22.61 28.83,22.32 TP1.1
OUT_RX: length 41.6
  Top Layer w0.152: U1.125 24.53,19.61 23.59,18.67 v1(23.59,16.64) ; v1(43.02,2.29) 45.47,4.73 USB1.3
  Bottom Layer w0.152: v1(23.59,16.64) 23.59,13.97 25.37,12.19 28.67,12.19 30.32,10.54 30.32,3.3 32.48,1.14 41.88,1.14 v1(43.02,2.29)
OUT_TX: length 43
  Top Layer w0.152: USB1.9 45.58,7.73 45.31,8 44.15,8 42.01,5.86 v1(42.01,3.17) ; U1.124 24.76,19.2 24.35,18.8 v1(24.35,17.4)
  Bottom Layer w0.152: v1(24.35,17.4) 24.35,14.1 25.75,12.7 29.05,12.7 30.83,10.92 30.83,3.56 32.61,1.78 41.5,1.78 42.01,2.29 v1(42.01,3.17)
PD20: length 12
  Top Layer w0.152: R13.1 4.92,18.8 5.11,18.61 5.11,13.53 6.45,12.19 9.24,12.19 9.46,12.41 U1.54
PE3: length 16.3
  Top Layer w0.203: U1.33 10.5,21.35 4.1,27.75 U6.A
PE12: length 21.4
  Top Layer w0.203: U6.B 12.1,35.62 11.66,36.07 8.61,36.07 8.1,35.56 8.1,33.02 7.59,32.51 7.59,25.65 11.01,22.23 11.93,22.23
PE13: length 17.3
  Top Layer w0.203: U1.31 12.33,21.25 12.16,21.08 11.53,21.08 6.7,25.91 6.7,34.41 6.62,34.49
PF0: length 12.8
  Top Layer w0.203: CARD1.8 24.54,31.81 23.97,31.24 23.97,26.03 21.93,23.99 21.93,22.23
PF1: length 13.9
  Top Layer w0.203: U1.8 21.53,24.36 23.47,26.29 23.47,31.75 24.27,32.56 CARD1.7
PF2: length 15.9
  Top Layer w0.203: U1.9 21.13,24.84 22.96,26.67 22.96,32.89 24.82,34.76 CARD1.5
PF3: length 17.8
  Top Layer w0.203: U1.10 20.73,25.33 22.45,27.05 22.45,33.78 25.62,36.96 CARD1.3
PF4: length 19.3
  Top Layer w0.203: U1.11 20.33,25.82 21.94,27.43 21.94,34.67 25.33,38.06 CARD1.2
PF5: length 20.6
  Top Layer w0.203: CARD1.1 25.16,39.16 21.43,35.43 21.43,27.81 19.93,26.31 19.93,22.23
PG8: length 4.1
  Top Layer w0.203: R29.2 25.3,24 24.92,23.62 23.85,23.62 23.53,23.31 U1.3
PG9: length 5.2
  Top Layer w0.152: U1.4 v1(23.13,20.95)
  Top Layer w0.203: v1(25.24,22.61) R28.2
  Bottom Layer w0.152: v1(25.24,22.61) 24.74,22.61 23.09,20.95 v1(23.13,20.95)
PG10: length 26.3
  Top Layer w0.203: U1.5 22.73,23.4 23.47,24.13 24.23,24.13 24.74,24.64 24.74,28.19 25.37,28.83 27.15,28.83 32.03,33.71 SW2.1
PG11: length 24
  Top Layer w0.203: v1(23.85,24.89) 23.59,24.89 22.33,23.63 U1.6 ; v1(20.29,34.67) 20.29,36.58 22.25,38.54 SW3.1
  Bottom Layer w0.203: v1(23.85,24.89) 20.29,28.45 v1(20.29,34.67)
RESET: length 9.5
  Top Layer w0.152: R1.1 11.48,25.71 12.2,24.98 C3.2 v1(12.42,24.13) ; v1(14.32,20.19) 13.93,20.58 13.93,22.23
  Bottom Layer w0.152: v1(12.42,24.13) 13.05,24.13 14.32,22.86 v1(14.32,20.19)
USB0_DM: length 31.2
  Top Layer w0.178: v1(44.8,6.48) 45.06,6.48
  Top Layer w0.203: U1.114 30.42,15.2 31.09,15.88 31.09,16.51 31.34,16.76 v1(34.64,16.76) ; USB1.7 45.31,6.73 45.06,6.48 45.06,6.1 45.43,5.73 USB1.5
  Bottom Layer w0.203: v1(34.64,16.76) 36.8,14.61 39.47,14.61 40.61,13.46 40.61,9.4 43.53,6.48 v1(44.8,6.48)
USB0_DP: length 32.4
  Top Layer w0.203: USB1.6 47.73,6.23 47.98,6.48 47.98,6.98 47.74,7.23 USB1.8 45.07,7.23 44.93,7.37 v1(44.8,7.37) ; U1.115 30.05,15.61 30.58,16.13 30.58,17.02 31.34,17.78 v1(35.02,17.78)
  Bottom Layer w0.203: v1(35.02,17.78) 37.44,15.37 39.85,15.37 41.25,13.97 41.25,9.65 43.53,7.37 v1(44.8,7.37)
USB1_DM: length 6.5
  Top Layer w0.203: TP4.1 31.59,15.49 30.91,14.81 U1.113
USB1_DP: length 6.4
  Top Layer w0.203: U1.112 31.03,14.41 31.59,13.84 TP5.1
VRA1: length 3.8
  Top Layer w0.152: U1.92 22.73,5.18 23.59,4.32 C7.2
VRA2: length 3.6
  Top Layer w0.152: 21.93,6.98 21.93,4.84 22.2,4.57 22.2,3.5 C8.2
X32KIN: length 14.1
  Top Layer w0.152: R2.2 9.13,30.48 C4.1 8.97,30.11 9.05,30.04 X2.2 9.05,27.63 9.75,26.92 13.56,26.92 14.07,26.42 14.07,25.27 14.73,24.61 U1.25
X32KOUT: length 11.9
  Top Layer w0.152: 10.82,30.48 11.69,30.48 C5.1 11.78,30.1 11.6,29.91 X2.1 11.6,27.62 11.91,27.31 13.69,27.31 14.32,26.67 14.32,25.53 15.13,24.72 U1.24
$2N8937: length 4.2
  Top Layer w0.152: D6.1 52.17,19.94
  Top Layer w0.381: U7.4 49.77,17.95 50.1,18.29 50.52,18.29 50.9,18.67 50.9,18.77 D6.1
$2N8946: length 1.5
  Top Layer w0.152: R30.2 49.87,19.22 U7.5
$5N1906: length 2.4
  Top Layer w0.152: USB1.10 45.67,8.23 R20.1
$5N1912: length 2.7
  Top Layer w0.152: R22.1 44.55,5.33 44.66,5.23 USB1.4

## Copper pours and planes (outline as drawn; the poured copper is in the pictures)
GND on Top Layer: 56.1,-2.29 -2.06,-2.29 -2.06,47.62 56.1,47.62
GND on Bottom Layer: 56.49,-2.16 -4.6,-2.16 -4.6,49.53 56.49,49.53
VCC_PMU on Top Layer: 36.1,5.08 37.41,5.08 37.41,3.43 36.1,3.43
LX3 on Top Layer: 36.48,5.96 37.37,5.96 37.37,4.06 36.48,4.06

Small or netless copper shapes (teardrops, artwork), in the pictures only: 455 on Top Layer, 115 on Bottom Layer

## Text on the board
Top Silkscreen Layer: R | T | GND | VCC | D- | D+ | CGND | JLCJLCJLCJLC | Li Thermal | 正极↑ | 注意极性→ | ↙大圆点对这个 | 小圆点对这个↗ | @小李电子实验室 | DIY热成像相机
